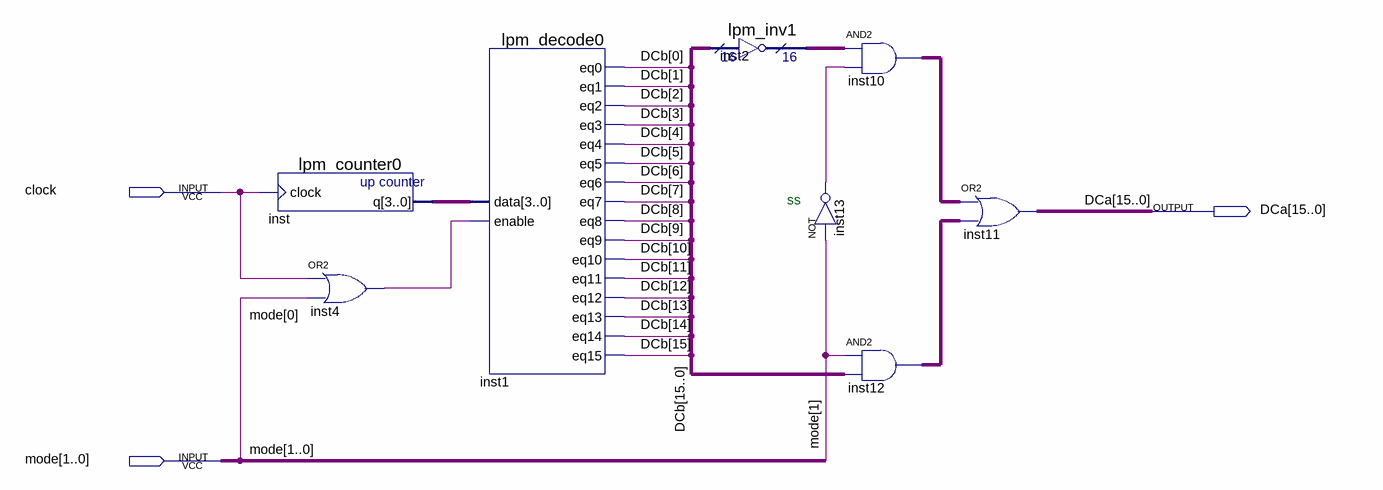
[diagram p0: schematic sheet]
// Quartus schematic BlockC.bdf as structural Verilog: 8 symbols, 3 pins
module BlockC (
  input  clock,
  input  [1:0] mode,
  output [15:0] DCa
);

  wire inst4_out, inst13_out;
  wire [3:0] inst_q;
  wire [15:0] DCb, inst2_result, inst10_out, inst12_out;

  lpm_counter0 inst (.clock(clock), .q(inst_q));
  or inst4 (inst4_out, clock, mode[0]);
  lpm_decode0 inst1 (
    .data(inst_q), .enable(inst4_out), .eq0(DCb[0]), .eq1(DCb[1]), .eq2(DCb[2]), .eq3(DCb[3]), .eq4(DCb[4]),
    .eq5(DCb[5]), .eq6(DCb[6]), .eq7(DCb[7]), .eq8(DCb[8]), .eq9(DCb[9]), .eq10(DCb[10]), .eq11(DCb[11]),
    .eq12(DCb[12]), .eq13(DCb[13]), .eq14(DCb[14]), .eq15(DCb[15]));
  lpm_inv1 inst2 (.data(DCb), .result(inst2_result));
  not inst13 (inst13_out, mode[1]);
  assign inst10_out = inst2_result & {16{inst13_out}};  // AND2 inst10, 16 bits wide
  assign inst12_out = {16{mode[1]}} & DCb;  // AND2 inst12, 16 bits wide
  assign DCa = inst10_out | inst12_out;  // OR2 inst11, 16 bits wide

  // Notes on the sheet:
  //   ss
endmodule
